# EAGLE design MU2_Wii (EAGLE 5.10)
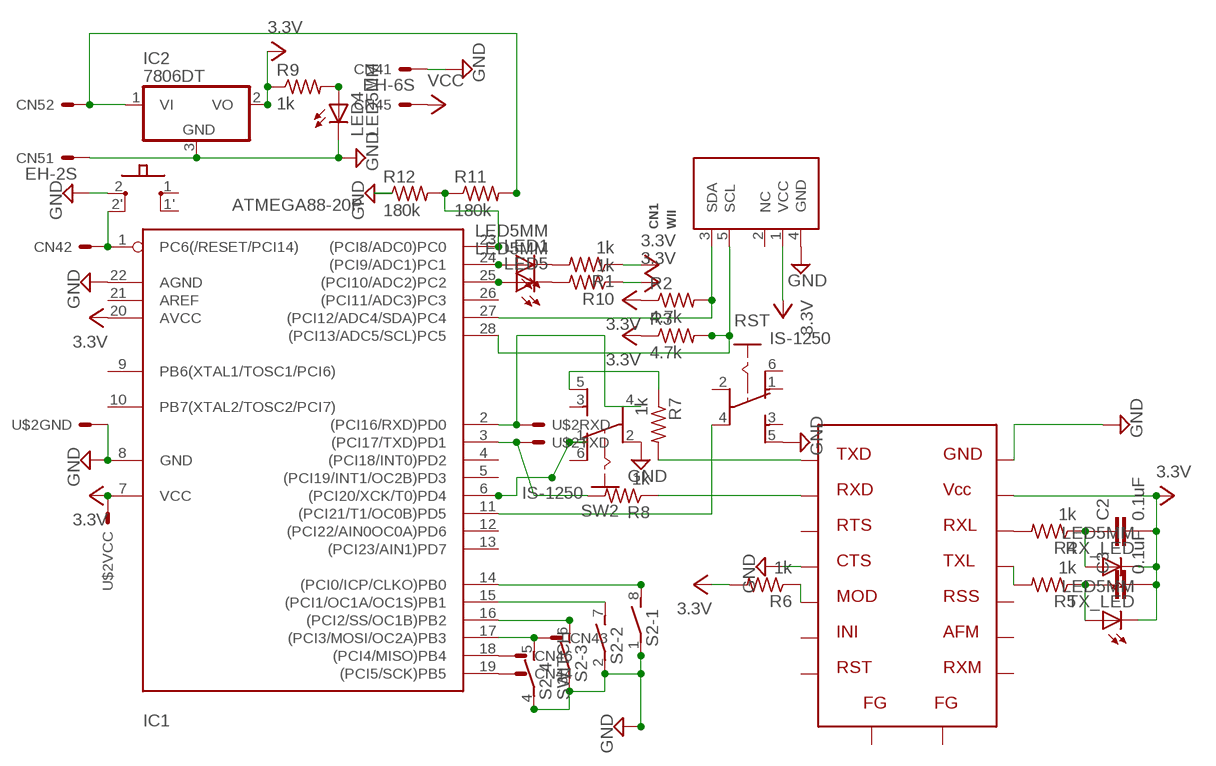
[diagram p0: schematic, sheet 1]

## Parts
C2  0.1uF  CERAMICCAPACITOR2012  [2012]
C3  0.1uF  CERAMICCAPACITOR2012  [2012]
CN1  WII  [WII]
CN4  EH-6S  [S6B-EH]
CN5  EH-2S  [S2B-EH]
IC1  ATMEGA88-20P  [DIL28-3]
IC2  7806DT  [TO252]
LED1  LED5MM  [LED5MM]
LED4  LED5MM  [LED5MM]
LED5  LED5MM  [LED5MM]
MU-1  MU-2  [MU-2]
R1  1k  R-US_M2012  [M2012]
R2  4.7k  R-US_M2012  [M2012]
R3  4.7k  R-US_M2012  [M2012]
R4  1k  R-US_M2012  [M2012]
R5  1k  R-US_M2012  [M2012]
R6  1k  R-US_M2012  [M2012]
R7  1k  R-US_M2012  [M2012]
R8  1k  R-US_M2012  [M2012]
R9  1k  R-US_M2012  [M2012]
R10  1k  R-US_M2012  [M2012]
R11  180k  R1/4W-7  [1/4-7]
R12  180k  R1/4W-7  [1/4-7]
RST  IS-1250  [IS-1250]
RX_LED  LED5MM  [LED5MM]
S1  TACTILE  [TACTILE]
S2  SWITCH  DIP04S  [DIP04S]
SW2  IS-1250  [IS-1250]
TX_LED  LED5MM  [LED5MM]
U$2  SERIAL  [S4B-EH]

## Nets
GND: CN1.4(GND) CN4.1 CN5.1 IC1.8(GND) IC1.22(AGND) IC2.3(GND) LED4.K(C) MU-1.4 MU-1.14 R12.1 RST.5 S1.2 S2.1 S2.2 S2.3 S2.4 SW2.2 U$2.4
N$1: IC1.23((PCI8/ADC0)PC0) R11.1 R12.2
N$3: CN4.3 IC1.17((PCI3/MOSI/OC2A)PB3) S2.5
N$4: LED1.K(C) R1.2
N$5: CN4.4 IC1.19((PCI5/SCK)PB5)
N$6: CN4.6 IC1.18((PCI4/MISO)PB4)
N$7: IC1.3((PCI17/TXD)PD1) R8.2 U$2.3
N$10: MU-1.12 R4.2
N$11: MU-1.11 R5.2
N$12: C2.1 R4.1 RX_LED.A
N$13: C3.1 R5.1 TX_LED.A
N$14: MU-1.5 R6.1
N$15: IC1.2((PCI16/RXD)PD0) SW2.4 U$2.2
N$16: CN5.2 IC2.1(VI) R11.2
N$17: IC1.16((PCI2/SS/OC1B)PB2) S2.6
N$19: IC1.24((PCI9/ADC1)PC1) LED1.A
N$20: IC1.14((PCI0/ICP/CLKO)PB0) S2.8
N$21: MU-1.1 R7.2
N$22: R7.1 SW2.5
N$24: IC1.6((PCI20/XCK/T0)PD4) SW2.1
N$26: MU-1.2 R8.1
N$27: LED4.A R9.2
N$28: IC1.15((PCI1/OC1A/OC1S)PB1) S2.7
N$29: LED5.K(C) R10.2
N$30: IC1.11((PCI21/T1/OC0B)PD5) RST.4
N$31: CN4.2 IC1.1(PC6(/RESET/PCI14)) S1.2'
N$32: IC1.25((PCI10/ADC2)PC2) LED5.A
SCL: CN1.5(SCL) IC1.28((PCI13/ADC5/SCL)PC5) R3.2
SDA: CN1.3(SDA) IC1.27((PCI12/ADC4/SDA)PC4) R2.2
VCC: C2.2 C3.2 CN1.1(VCC) CN4.5 IC1.7(VCC) IC1.20(AVCC) IC2.2(VO) MU-1.13 R1.1 R2.1 R3.1 R6.2 R9.1 R10.1 RX_LED.K(C) TX_LED.K(C) U$2.1 ; supply symbol labelled 3.3V
Unconnected: CN1.2(NC) IC1.4((PCI18/INT0)PD2) IC1.5((PCI19/INT1/OC2B)PD3) IC1.9(PB6(XTAL1/TOSC1/PCI6)) IC1.10(PB7(XTAL2/TOSC2/PCI7)) IC1.12((PCI22/AIN0OC0A)PD6) IC1.13((PCI23/AIN1)PD7) IC1.21(AREF) IC1.26((PCI11/ADC3)PC3) MU-1.3 MU-1.6 MU-1.7 MU-1.8 MU-1.9 MU-1.10 MU-1.FG1 MU-1.FG2 RST.1 RST.2 RST.3 RST.6 S1.1 S1.1' SW2.3 SW2.6

## Library data of the parts
C2 C3 = Capacitor:CERAMICCAPACITOR: Ceramic Capacitor
CN1 = wii:WII
CN4 = Connector:EH-6
CN5 = Connector:EH-2
IC1 = avr:ATMEGA88*P: MICROCONTROLLER 8 kBytes FLASH 1 kBytes SRAM 512 Bytes EEPROM USART 8-channel 10 bit ADC
IC2 = linear:78*: Positive VOLTAGE REGULATOR Source: http://cache.national.com/ds/LM/LM78L05.pdf http://www.fairchildsemi.com/ds/LM/LM7805.pdf
LED1 LED4 LED5 RX_LED TX_LED = led:LED
MU-1 = MU-2:MU-2
R1-R10 = rcl:R-US_: RESISTOR, American symbol
R11 R12 = resistor:R
RST SW2 = switch:IS-1250
S1 = Switch1:TACTILE
S2 = switch:DIP04S: DIL/CODE SWITCH
U$2 = Connector_4pin:SERIAL

## Board
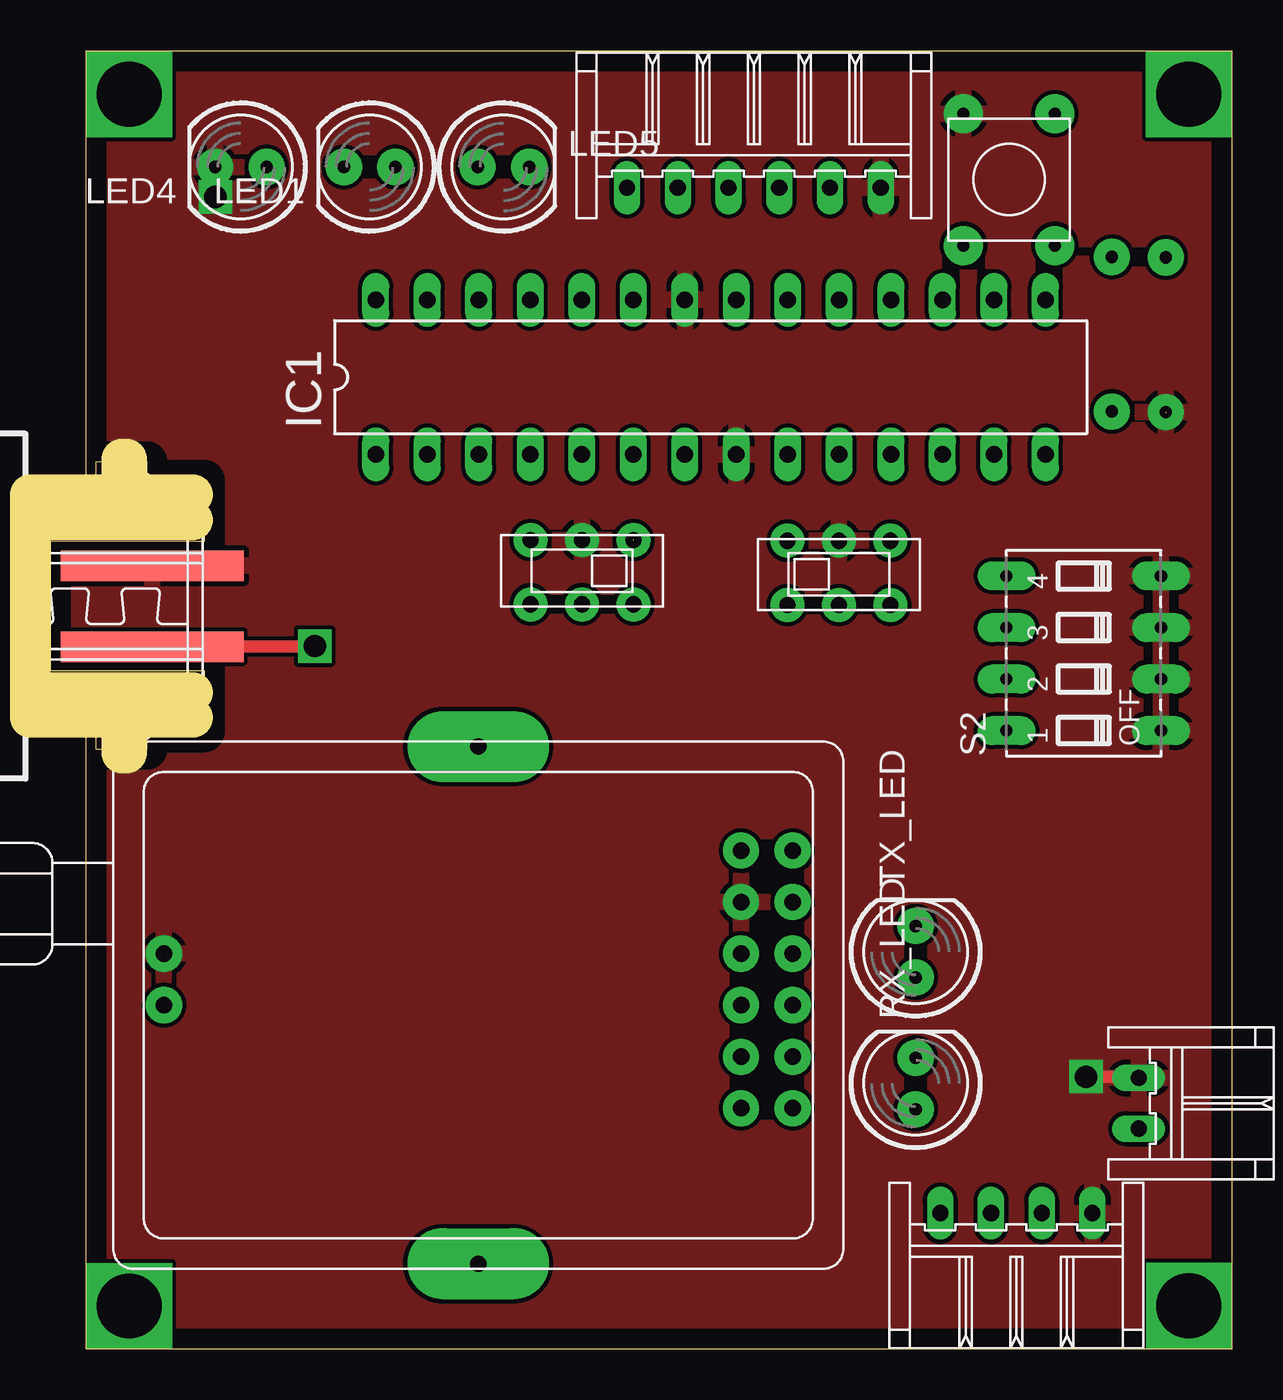
[diagram p1: board, top side]
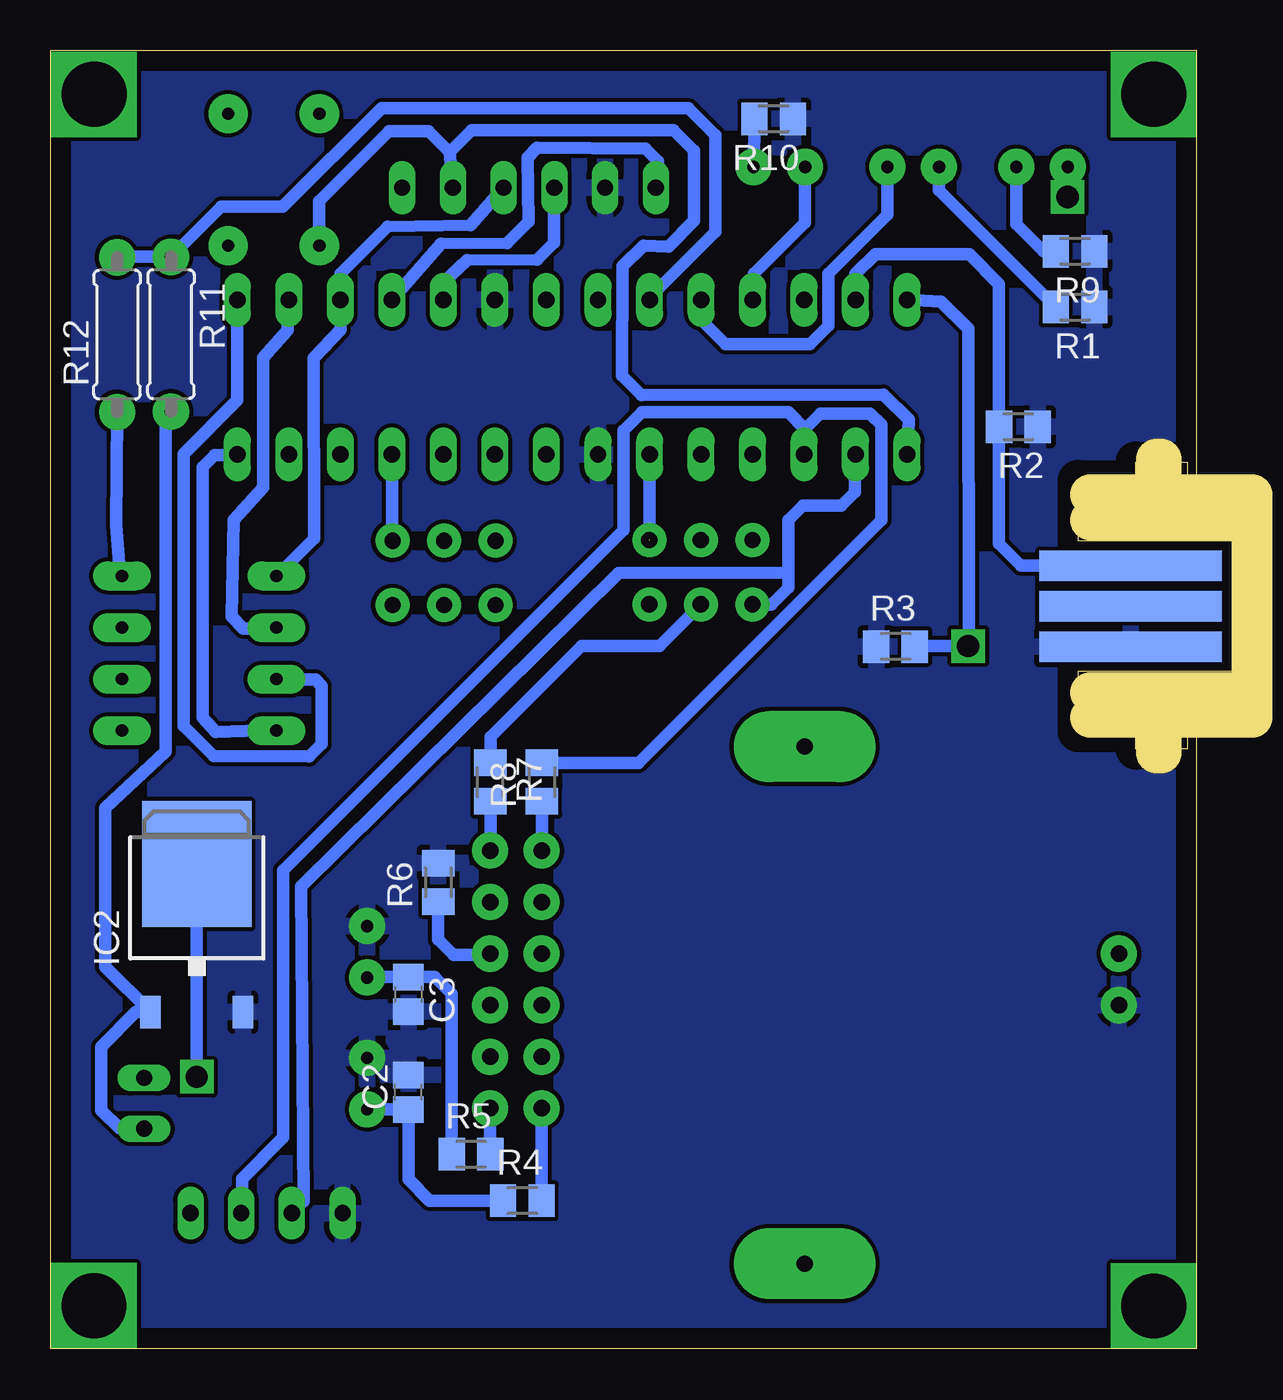
[diagram p2: board, bottom side, seen from below]

Size 58.25 x 64 mm. Coordinates in mm from the lower left corner, seen from the top.
Outline: 1.75,0 58.25,0 58.25,64 1.75,64 1.75,42.81 2.21,42.81 2.21,43.72 4.75,43.72 4.75,42.81 7.59,42.81 7.59,39.81 0,39.81 0,33.43 7.59,33.43 7.59,30.42 4.75,30.42 4.75,29.57 2.21,29.57 2.21,30.42 1.75,30.42 1.75,0
Copper layers (1*16): Top 0.035mm / dielectric 1.5mm / Bottom 0.035mm
Design rules "default": minimum track width 10mil, minimum drill 24mil, track to track 8mil, track to pad 8mil, pad to pad 8mil, via to via 8mil, smd to smd 8mil, copper to edge 40mil, drill to drill 8mil, minimum pad ring 10mil, minimum via ring 8mil, stop-mask expansion 4mil, vias tented up to drill 0mil, thermal gap 10mil

### Footprints (pad centres in the part's own frame; a part is rotated, then mirrored left to right if it is on the bottom)
2012 = smd 1.3 x 1.5: 1 -0.85,0; 2 0.85,0
WII = smd 1.5 x 9 bottom: 1 -2,-3.25; 2 0,-3.25; 3 2,-3.25 | smd 1.5 x 9: 4 2,-3.25; 5 -2,-3.25
S6B-EH = drill 0.8 pad 1.27 long: 1 6.25,-0.02; 2 3.75,-0.02; 3 1.25,-0.02; 4 -1.25,-0.02; 5 -3.75,-0.02; 6 -6.25,-0.02
S2B-EH = drill 0.8 pad 1.27 long: 1 -1.25,0; 2 1.25,0
DIL28-3 = drill 0.813 long: 1 -16.51,-3.81; 2 -13.97,-3.81; 3 -11.43,-3.81; 4 -8.89,-3.81; 5 -6.35,-3.81; 6 -3.81,-3.81; 7 -1.27,-3.81; 8 1.27,-3.81; 9 3.81,-3.81; 10 6.35,-3.81; 11 8.89,-3.81; 12 11.43,-3.81; 13 13.97,-3.81; 14 16.51,-3.81; 15 16.51,3.81; 16 13.97,3.81; 17 11.43,3.81; 18 8.89,3.81; 19 6.35,3.81; 20 3.81,3.81; 21 1.27,3.81; 22 -1.27,3.81; 23 -3.81,3.81; 24 -6.35,3.81; 25 -8.89,3.81; 26 -11.43,3.81; 27 -13.97,3.81; 28 -16.51,3.81
TO252 = smd 1 x 1.6: 1 -2.28,-4.8; 2 2.28,-4.8 | smd 5.4 x 6.2: 3 0,2.5
LED5MM = drill 0.6 pad 1.778 round: A -1.27,0; K 1.27,0
MU-2 = drill 0.8 pad 1.778 round: 1 15.5,7.62; 2 12.96,7.62; 3 15.5,5.08; 4 12.96,5.08; 5 15.5,2.54; 6 12.96,2.54; 7 15.5,0; 8 12.96,0; 9 15.5,-2.54; 10 12.96,-2.54; 11 15.5,-5.08; 12 12.96,-5.08; 13 -15.5,0; 14 -15.5,2.54 | drill 0.8 pad 3.5 long: FG1 0,12.75; FG2 0,-12.75
M2012 = smd 1.3 x 1.6: 1 -0.95,0; 2 0.95,0
1/4-7 = drill 0.6 pad 1.778 round: 1 -3.81,0; 2 3.81,0
IS-1250 = drill 0.8 pad 1.676 round: 1 -2.54,-1.27; 2 0,-1.27; 3 2.54,-1.27; 4 2.54,1.905; 5 0,1.905; 6 -2.54,1.905
TACTILE = drill 0.6 pad 1.93 round: 1 -3.25,2.25; 1' 3.25,2.25; 2 -3.25,-2.25; 2' 3.25,-2.25
DIP04S = drill 0.6 pad 1.422 long: 1 -3.81,-3.81; 2 -1.27,-3.81; 3 1.27,-3.81; 4 3.81,-3.81; 5 3.81,3.81; 6 1.27,3.81; 7 -1.27,3.81; 8 -3.81,3.81
S4B-EH = drill 0.8 pad 1.27 long: 1 3.75,-3.83; 2 1.25,-3.83; 3 -1.25,-3.83; 4 -3.75,-3.83

### Placement (x,y rotation side)
C2  40.61,12.65 90 bottom
C3  40.61,17.48 270 bottom
CN1  1.75,36.61 90 top
CN4  34.67,57.27 0 top
CN5  53.64,12.1 270 top
IC1  32.54,47.9 0 top
IC2  51.05,21.4 0 bottom
LED1  15.72,58.27 180 top
LED4  9.37,58.27 180 top
LED5  22.33,58.27 0 top
MU-1  21.08,16.94 0 top
R1  7.75,51.36 180 bottom
R2  10.54,45.47 180 bottom
R3  16.6,34.62 0 bottom
R4  35,7.3 0 bottom
R5  37.53,9.59 0 bottom
R6  39.14,23 90 bottom
R7  36.58,27.94 270 bottom
R8  34.04,27.94 90 bottom
R9  7.75,54.11 180 bottom
R10  22.61,60.64 180 bottom
R11  52.32,50.03 270 bottom
R12  54.98,50 90 bottom
RST  38.86,37.93 0 top
RX_LED  42.65,13.08 90 top
S1  47.26,57.65 270 top
S2  50.93,34.29 90 top
SW2  26.2,38.61 180 top
TX_LED  42.65,19.57 90 top
U$2  47.61,2.86 180 top

### Tracks (layer width: path | path; a pad name or v marks a point on that pad's centre or on a via)
GND  (via drill 1.1)  (1 unrouted)
  Top 0.61: v51.05,13.41 53.59,13.41 CN5.1
  Bottom 0.61: v51.05,13.41 IC2.3 | 54.83,38.06 55.03,40.6 54.98,46.13
  other vias: 8.12,56.79
  pour Top: 0.88,65.2 59.92,64.27 60.83,-1.65 0.77,-0.8
N$1
  Bottom 0.61: IC1.23 28.73,51.83 25.48,55.08 25.48,59.84 26.81,61.18 41.95,61.18 46.82,56.3 49.86,56.3 R11.1 54.95,53.84 R12.2
N$3
  Bottom 0.559: 41.63,55.33 37.55,55.41
  Bottom 0.61: S2.5 45.28,39.96 45.3,48.84 43.97,50.25 IC1.17 43.97,53.01 41.63,55.33 | 37.55,55.41 CN4.3
N$4
  Bottom 0.61: LED1.K 14.45,57.11 R1.2
N$5
  Bottom 0.559: 34.28,53.7 37.72,53.68
  Bottom 0.61: IC1.19 38.89,52.58 37.72,53.68 | 34.28,53.7 33.43,54.55 CN4.4
N$6
  Bottom 0.559: 35.75,54.51 39,54.48
  Bottom 0.61: CN4.6 28.32,58.56 28.93,59.17 34.26,59.22 34.75,58.74 34.7,55.56 35.75,54.51 | 39,54.48 IC1.18
N$7
  Bottom 0.61: IC1.3 21.11,45.3 21.06,45.35 | 21.06,45.35 20.29,46.11 17.86,46.11 17.3,45.55 17.3,40.86 29.26,28.89 R8.2 | 21.06,45.35 21.88,46.18 29.11,46.18 30.01,45.28 30.01,40.36 46.79,23.58 46.79,10.41 48.82,8.38 48.82,6.73 U$2.3
N$8  (via drill 3.2)
  other vias: 3.87,61.85
N$9  (via drill 3.2)
  other vias: 56.11,61.85
N$10
  Bottom 0.61: MU-1.12 34.04,7.31 R4.2
N$11
  Bottom 0.61: R5.2 MU-1.11
N$12
  Bottom 0.61: R4.1 39.57,7.3 40.61,8.34 C2.1 42.63,11.8 RX_LED.A
N$13
  Bottom 0.61: R5.1 38.48,17.49 39.32,18.33 C3.1 42.62,18.32 TX_LED.A
N$14
  Bottom 0.61: 36.6,19.5 MU-1.5 36.65,19.42 38.38,19.42 39.14,20.18 R6.1
N$15
  Bottom 0.61: SW2.4 22.72,36.7 21.88,37.54 21.88,38.28 | 21.88,38.28 21.88,40.86 21.16,41.58 19.27,41.58 18.61,42.24 18.61,44.06 IC1.2 | 21.88,38.28 30.26,38.24 45.9,22.8 45.78,7.27 U$2.2
N$16
  Bottom 0.61: CN5.2 54.85,10.86 55.75,11.76 55.75,14.9 54.05,16.6 IC2.1 55.58,18.84 55.58,26.66 52.58,29.44 52.58,45.96 R11.2
N$17
  Bottom 0.61: IC1.16 46.57,50.22 47.79,48.86 47.79,42.47 49.24,40.86 49.34,36.09 48.76,35.51 47.17,35.51 S2.6
N$19
  Bottom 0.61: IC1.24 26.19,50.75 24.98,49.54 20.82,49.54 19.91,50.44 19.91,53.01 17.01,55.92 17.01,58.26 LED1.A
N$20
  Bottom 0.61: S2.8 47.16,30.52 50.13,30.4 50.75,31.13 50.75,43.47 50.16,44.06 49.09,44.06 IC1.14
N$21
  Bottom 0.61: R7.2 MU-1.1
N$22
  Bottom 0.61: R7.1 36.58,30.16 32.08,34.66 28.24,34.66 SW2.5
N$23  (via drill 3.2)
  other vias: 56.12,2.12
N$24  (1 unrouted)
  Bottom 0.61: 28.73,39.89 IC1.6
N$25  (via drill 3.2)
  other vias: 3.87,2.11
N$26
  Bottom 0.61: R8.1 MU-1.2
N$27
  Bottom 0.61: 10.65,58.26 LED4.A 10.64,55.44 9.32,54.12 R9.2
N$28
  Bottom 0.61: S2.7 47.1,32.99 45.2,32.99 44.89,32.69 44.89,29.82 45.52,29.2 50.23,29.23 51.7,30.71 51.7,44.11 49.05,46.76 IC1.15
N$29
  Bottom 0.61: R10.2 23.59,58.26 LED5.K
N$30
  Bottom 0.61: IC1.11 41.43,39.87 RST.4
N$31
  Bottom 0.61: IC1.1 16.01,44.11 15.95,45.81 17.2,47.05 29.12,47.02 30.09,47.98 30.05,53.37 29.02,54.39 27.8,54.34 26.53,55.61 26.53,59.07 27.55,60.08 37.5,60.07 38.59,58.99 | 38.59,58.99 CN4.2 | S1.2' 45.01,56.59 41.58,60.02 39.62,60.02 38.59,58.99
N$32
  Bottom 0.61: LED5.A 21.06,55.52 23.57,53.01 23.57,51.79 IC1.25
SCL  (via drill 1.1)
  Top 0.61: CN1.5 12.99,34.61 v13.02,34.65
  Bottom 0.61: R3.2 15.62,34.65 v13.02,34.65 12.99,35.14 13.02,50.29 14.36,51.64 IC1.28
SDA
  Bottom 0.61: CN1.3 10.41,38.61 11.51,39.71 11.51,44.76 11.51,45.45 | 11.51,45.45 R2.2 | IC1.27 18.57,53 17.6,53.96 12.97,53.96 11.51,52.5 11.51,45.45
  Bottom 1.27: 3.84,38.59 3.72,38.48 4.87,38.48 CN1.3
VCC
  pour Bottom: 0.84,65.09 59.31,64.95 60.07,-1.23 0.77,-0.71